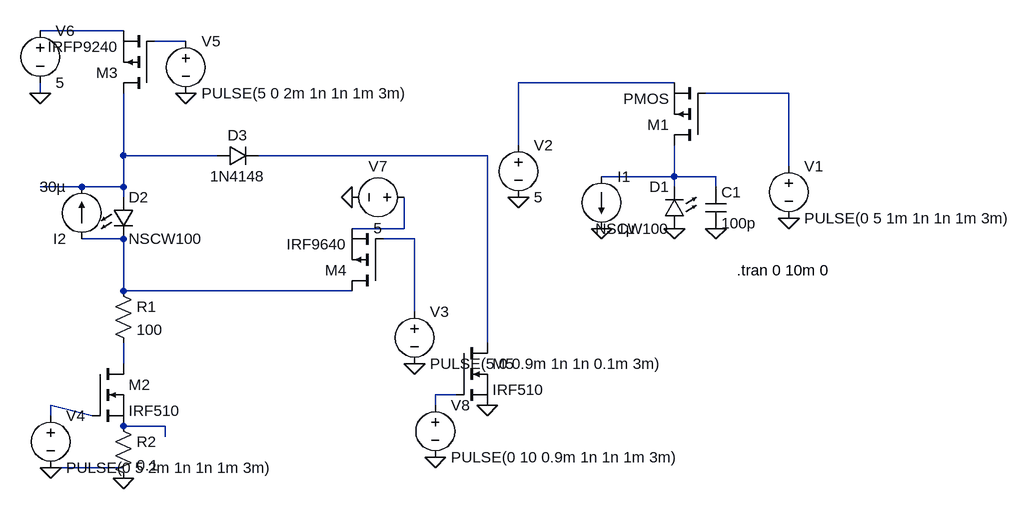
[diagram p0: schematic led_photocurrent.asc]
led_photocurrent.asc, the LTspice schematic file:
Version 4
SHEET 1 880 680
WIRE -560 -96 -688 -96
WIRE -464 -80 -512 -80
WIRE 288 -16 48 -16
WIRE -688 0 -688 -16
WIRE 464 0 336 0
WIRE 48 80 48 -16
WIRE -560 96 -560 0
WIRE -416 96 -560 96
WIRE 0 96 -352 96
WIRE 464 112 464 0
WIRE 288 128 288 80
WIRE 288 128 176 128
WIRE 352 128 288 128
WIRE -624 144 -688 144
WIRE -560 144 -560 96
WIRE -560 144 -624 144
WIRE 288 144 288 128
WIRE 352 144 352 128
WIRE -560 160 -560 144
WIRE -128 208 -128 160
WIRE -128 208 -208 208
WIRE -560 224 -624 224
WIRE -112 224 -160 224
WIRE -560 304 -560 224
WIRE -208 304 -560 304
WIRE -112 336 -112 224
WIRE 0 384 0 96
WIRE -560 416 -560 384
WIRE -48 464 -80 464
WIRE -80 480 -80 464
WIRE -672 496 -672 480
WIRE -608 496 -672 480
WIRE -496 512 -560 512
WIRE -496 528 -496 512
WIRE -560 576 -672 576
FLAG 464 192 0
FLAG 288 208 0
FLAG 48 160 0
FLAG 352 208 0
FLAG 176 208 0
FLAG 0 480 0
FLAG -112 416 0
FLAG -672 576 0
FLAG -464 0 0
FLAG -688 0 0
FLAG -80 560 0
FLAG -560 592 0
FLAG -208 160 0
SYMBOL LED 304 208 R180
WINDOW 0 24 64 Left 2
WINDOW 3 24 0 Left 2
SYMATTR InstName D1
SYMATTR Value NSCW100
SYMATTR Description Diode
SYMATTR Type diode
SYMBOL pmos 336 80 R180
SYMATTR InstName M1
SYMBOL voltage 464 96 R0
WINDOW 123 0 0 Left 2
WINDOW 39 0 0 Left 2
SYMATTR InstName V1
SYMATTR Value PULSE(0 5 1m 1n 1n 1m 3m)
SYMBOL voltage 48 64 R0
WINDOW 123 0 0 Left 2
WINDOW 39 0 0 Left 2
SYMATTR InstName V2
SYMATTR Value 5
SYMBOL cap 336 144 R0
SYMATTR InstName C1
SYMATTR Value 100p
SYMBOL current 176 128 R0
WINDOW 123 0 0 Left 2
WINDOW 39 0 0 Left 2
SYMATTR InstName I1
SYMATTR Value 1µ
SYMBOL LED -576 160 R0
SYMATTR InstName D2
SYMATTR Value NSCW100
SYMATTR Description Diode
SYMATTR Type diode
SYMBOL diode -416 112 R270
WINDOW 0 32 32 VTop 2
WINDOW 3 0 32 VBottom 2
SYMATTR InstName D3
SYMATTR Value 1N4148
SYMBOL res -576 288 R0
SYMATTR InstName R1
SYMATTR Value 100
SYMBOL nmos -608 416 R0
SYMATTR InstName M2
SYMATTR Value IRF510
SYMBOL pmos -512 0 R180
SYMATTR InstName M3
SYMATTR Value IRFP9240
SYMBOL pmos -160 304 R180
SYMATTR InstName M4
SYMATTR Value IRF9640
SYMBOL current -624 224 R180
WINDOW 123 0 0 Left 2
WINDOW 39 0 0 Left 2
SYMATTR InstName I2
SYMATTR Value 30µ
SYMBOL voltage -112 320 R0
WINDOW 123 0 0 Left 2
WINDOW 39 0 0 Left 2
SYMATTR InstName V3
SYMATTR Value PULSE(5 0 0.9m 1n 1n 0.1m 3m)
SYMBOL nmos -48 384 R0
SYMATTR InstName M5
SYMATTR Value IRF510
SYMBOL voltage -672 480 R0
WINDOW 123 0 0 Left 2
WINDOW 39 0 0 Left 2
SYMATTR InstName V4
SYMATTR Value PULSE(0 5 2m 1n 1n 1m 3m)
SYMBOL voltage -464 -96 R0
WINDOW 123 0 0 Left 2
WINDOW 39 0 0 Left 2
SYMATTR InstName V5
SYMATTR Value PULSE(5 0 2m 1n 1n 1m 3m)
SYMBOL voltage -688 -112 R0
WINDOW 123 0 0 Left 2
WINDOW 39 0 0 Left 2
SYMATTR InstName V6
SYMATTR Value 5
SYMBOL voltage -112 160 R90
WINDOW 0 -32 56 VBottom 2
WINDOW 3 32 56 VTop 2
WINDOW 123 0 0 Left 2
WINDOW 39 0 0 Left 2
SYMATTR InstName V7
SYMATTR Value 5
SYMBOL voltage -80 464 R0
WINDOW 123 0 0 Left 2
WINDOW 39 0 0 Left 2
SYMATTR InstName V8
SYMATTR Value PULSE(0 10 0.9m 1n 1n 1m 3m)
SYMBOL res -576 496 R0
SYMATTR InstName R2
SYMATTR Value 0.1
TEXT 384 272 Left 2 !.tran 0 10m 0

The netlist it stands for:
* led_photocurrent.asc
D1 0 N007 NSCW100
M1 N007 N004 N003 N003 PMOS
V1 N004 0 PULSE(0 5 1m 1n 1n 1m 3m)
V2 N003 0 5
C1 N007 0 100p
I1 N007 0 1µ
D2 N005 N009 NSCW100
D3 N005 N006 1N4148
R1 N009 N011 100
M2 N011 N013 N014 N014 IRF510
M3 N005 N002 N001 N001 IRFP9240
M4 N009 N010 N008 N008 IRF9640
I2 N009 N005 30µ
V3 N010 0 PULSE(5 0 0.9m 1n 1n 0.1m 3m)
M5 N006 N012 0 0 IRF510
V4 N013 0 PULSE(0 5 2m 1n 1n 1m 3m)
V5 N002 0 PULSE(5 0 2m 1n 1n 1m 3m)
V6 N001 0 5
V7 N008 0 5
V8 N012 0 PULSE(0 10 0.9m 1n 1n 1m 3m)
R2 N014 0 0.1
.model D D
.lib standard.dio
.model NMOS NMOS
.model PMOS PMOS
.lib standard.mos
.tran 0 10m 0
.backanno
.end